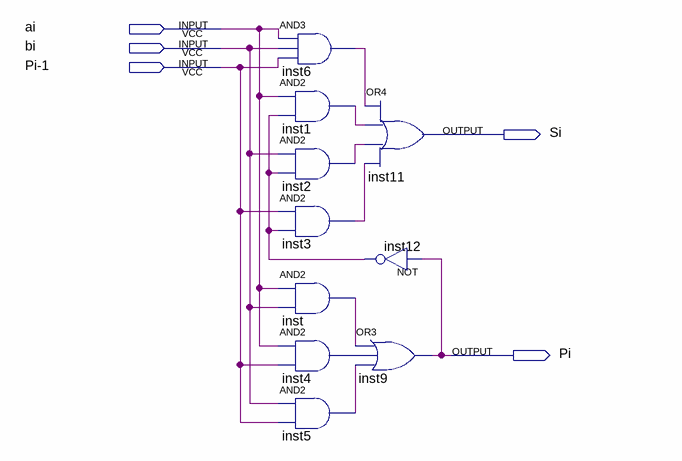
[diagram p0: schematic sheet]
// Quartus schematic SM.bdf as structural Verilog: 10 symbols, 5 pins
module SM (
  input  ai,
  input  bi,
  input  \Pi-1 ,
  output Si,
  output Pi
);

  wire inst1_out, inst2_out, inst3_out, inst4_out, inst5_out, inst6_out, inst12_out, inst_out;

  and inst6 (inst6_out, ai, bi, \Pi-1 );
  and inst1 (inst1_out, ai, inst12_out);
  and inst2 (inst2_out, bi, inst12_out);
  and inst3 (inst3_out, \Pi-1 , inst12_out);
  and inst (inst_out, ai, bi);
  and inst4 (inst4_out, ai, \Pi-1 );
  and inst5 (inst5_out, bi, \Pi-1 );
  or inst11 (Si, inst6_out, inst1_out, inst2_out, inst3_out);
  not inst12 (inst12_out, Pi);
  or inst9 (Pi, inst_out, inst4_out, inst5_out);
endmodule
